# Altium schematic sheet diagramaInterior.SchDoc
size A
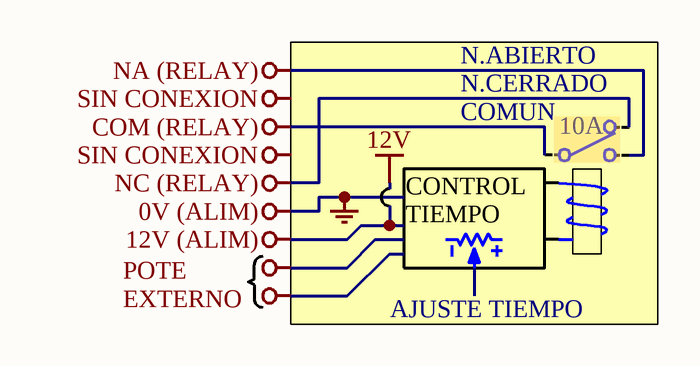
[diagram p0: diagramaInterior.SchDoc]

## Parts
K?  Relay2  [RELAY2]  (value not drawn)
R?  Set Position: AJUSTE TIEMPO  [conpol4x1]  (hidden comment: RVar)  (part A of 2)

## Nets
COM (RELAY): K?.1
NA (RELAY): K?.3
NC (RELAY): K?.2

Not connected (* = marked no-connect by the designer): K? 4 5; R? 1 2 3

## Notes on the sheet
- (near K?) N.ABIERTO
- (near K?) N.CERRADO
- (near K?) COMUN
- (near K?) 10A
- POTE EXTERNO
- (near R?) CONTROL TIEMPO
- Labels drawn without touching a wire or pin: SIN CONEXION

## Library data of the parts
K? = Relay2: Relay; Price: ?; Current: ?
R? = RVar: Resistencia Variable; Value: 1K